# EAGLE design XIAO-MIC (EAGLE 9.6.2)
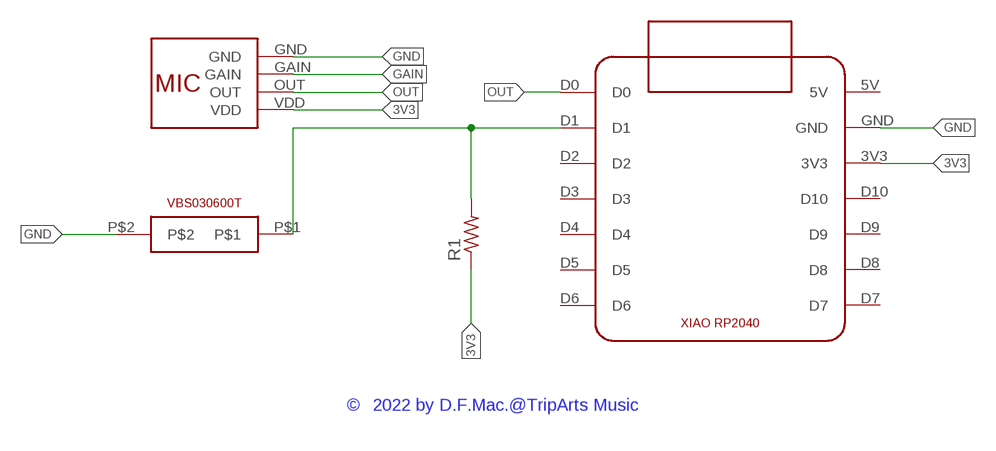
[diagram p0: schematic, sheet 1]

## Parts
R1  R-US_R0805  [R0805]
U$1  MEMS-MIC  [MEMS-MIC-LANGLE]
U$2  VBS030600T  [VBS030600T]
U$3  XIAO-RP2040  [XIAO-RP2040]

## Nets
3V3: R1.1 U$1.VDD U$3.3V3
GAIN: U$1.GAIN
GND: U$1.GND U$2.P$2 U$3.GND
N$1: R1.2 U$2.P$1 U$3.D1
OUT: U$1.OUT U$3.D0
Unconnected: U$3.5V U$3.D2 U$3.D3 U$3.D4 U$3.D5 U$3.D6 U$3.D7 U$3.D8 U$3.D9 U$3.D10

## Notes on the sheet
- ©︎2022 by D.F.Mac.@TripArts Music

## Library data of the parts
R1 = 0my:R-US_: RESISTOR, American symbol
U$1 = xiao:MEMS-MIC
U$2 = xiao:VBS030600T
U$3 = xiao:XIAO-RP2040

## Board
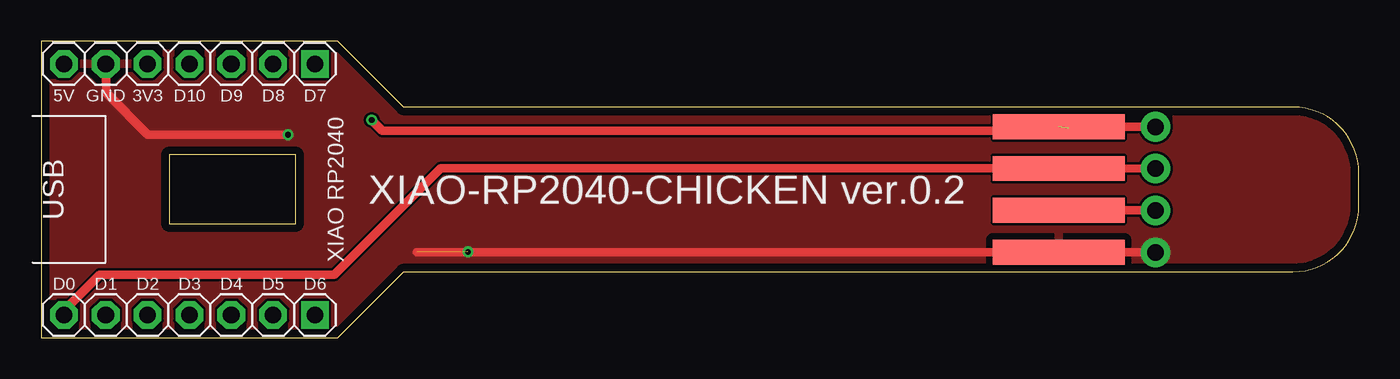
[diagram p1: board, top side]
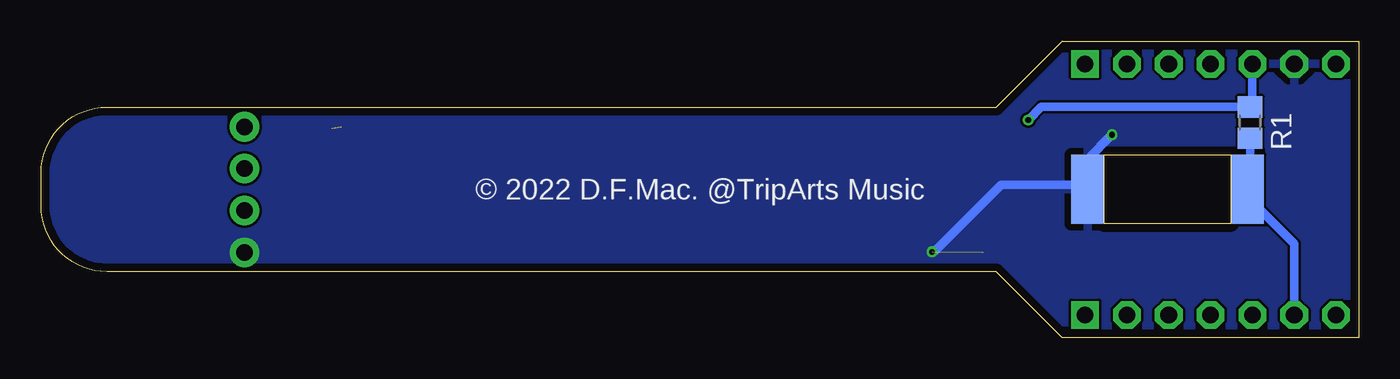
[diagram p2: board, bottom side, seen from below]

Size 80 x 18 mm. Coordinates in mm from the lower left corner, seen from the top.
Outline: 0,0 18,0 22,4 76,4 arc90 80,8 80,10 arc90 76,14 22,14 18,18 0,18 0,0
Copper layers (1*16): Top 0.035mm / dielectric 1.6mm / Bottom 0.035mm
Design rules "Elecrow_2-layer_PCB_eagle_rule *": minimum track width 6mil, minimum drill 12mil, track to track 6mil, track to pad 6mil, pad to pad 6mil, via to via 8mil, smd to smd 0mil, copper to edge 20mil, drill to drill 10mil, minimum pad ring 6mil, minimum via ring 6mil, stop-mask expansion 0mil, vias tented up to drill 100mil, thermal gap 16mil

### Footprints (pad centres in the part's own frame; a part is rotated, then mirrored left to right if it is on the bottom)
R0805 = smd 1.3 x 1.5: 1 -0.95,0; 2 0.95,0
MEMS-MIC-LANGLE = smd 8 x 1.5: GAIN 0,1.27; GND 0,3.81; OUT 0,-1.27; VDD 0,-3.81
VBS030600T = smd 2 x 4.2: P$1 -4.8,0; P$2 4.9,0
XIAO-RP2040 = drill 1.016 pad 1.676 octagon: 3V3 7.62,2.54; 5V 7.62,7.62; D0 -7.62,7.62; D1 -7.62,5.08; D2 -7.62,2.54; D3 -7.62,0; D4 -7.62,-2.54; D5 -7.62,-5.08; D8 7.62,-5.08; D9 7.62,-2.54; D10 7.62,0; GND 7.62,5.08 | drill 1.016 pad 1.676 square: D6 -7.62,-7.62; D7 7.62,-7.62

### Placement (x,y rotation side)
R1  6.61,13.06 270 bottom
U$1  61.78,9 180 top
U$2  11.56,9.02 180 bottom
U$3  9,9 90 top

### Tracks (layer width: path | path; a pad name or v marks a point on that pad's centre or on a via)
3V3  (via drill 0.35)  (1 unrouted)
  Top 0.508: v20.06,13.21 20.7,12.57 62.23,12.57 62.36,12.7
  Bottom 0.508: U$3.3V3 6.46,14.15 R1.1 19.27,14.01 v20.06,13.21
GAIN  (via drill 1 pad 1.8)
  Top 0.508: v67.66,7.72 U$1.GAIN
GND  (via drill 0.35, 1 pad 1.8)  (1 unrouted)
  Top 0.152: 67.42,5.18 67.3,5.3
  Top 0.508: 67.42,5.18 v67.66,5.18 U$1.GND 22.81,5.19 | U$3.GND 3.94,16.6 3.94,14.86 6.48,12.32 v14.99,12.32
  Bottom 0.508: v14.99,12.32 16.46,10.84 U$2.P$2 16.72,9.27 21.72,9.27 25.78,5.21 v25.91,5.21
  pour Top: -2,20 82,20 82,-2 -2,-2
  pour Bottom: -4,20 -4,-2 82,-2 82,20
N$1
  Bottom 0.508: R1.2 6.61,9.17 U$2.P$1 6.76,8.54 3.92,5.7 U$3.D1
OUT  (via drill 1 pad 1.8)
  Top 0.152: 67.44,10.26 67.4,10.3
  Top 0.508: 67.44,10.26 v67.66,10.26 U$1.OUT 61.76,10.29 24.26,10.29 17.78,3.81 3.56,3.81 1.38,1.63 U$3.D0
VDD  (via drill 1 pad 1.8)
  Top 0.508: v67.66,12.8 63.3,12.8

### Text on the board
tNames: XIAO-RP2040-CHICKEN ver.0.2
bNames: © 2022 D.F.Mac. @TripArts Music